# Altium project Power-LED Regulator.PrjPCB
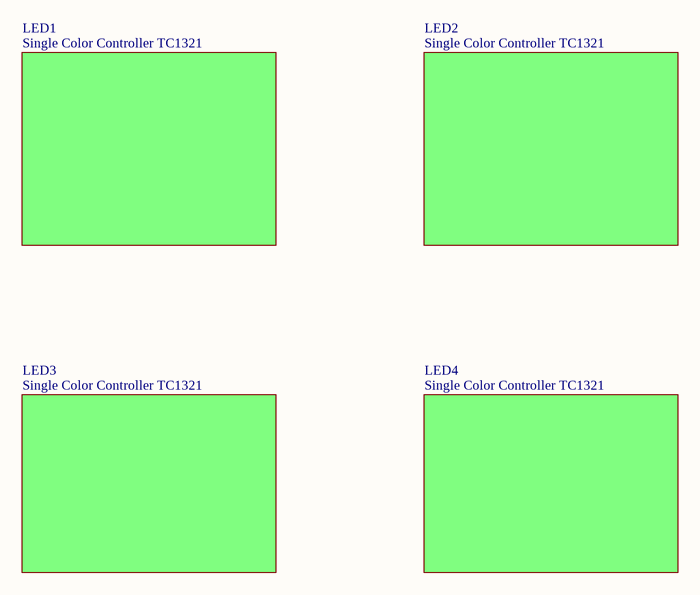
[diagram p0: Top.SchDoc]
4 sheets, 32 parts. Net scope: flat (ports and power ports of the same name join across sheets).
Sheets:
  Top.SchDoc
    LED3 = Single Color Controller TC1321.SchDoc
      Regulator = Current Controller LM258.SchDoc
      Step-Up = Boost Converter XL6009.SchDoc
    LED1 = Single Color Controller TC1321.SchDoc
      Regulator = Current Controller LM258.SchDoc
      Step-Up = Boost Converter XL6009.SchDoc
    LED4 = Single Color Controller TC1321.SchDoc
      Regulator = Current Controller LM258.SchDoc
      Step-Up = Boost Converter XL6009.SchDoc
    LED2 = Single Color Controller TC1321.SchDoc
      Regulator = Current Controller LM258.SchDoc
      Step-Up = Boost Converter XL6009.SchDoc

## Sheet Top.SchDoc
size A4

### Sub-sheets
LED1 = Single Color Controller TC1321: no entries
LED2 = Single Color Controller TC1321: no entries
LED3 = Single Color Controller TC1321: no entries
LED4 = Single Color Controller TC1321: no entries

## Sheet Single Color Controller TC1321.SchDoc
size A4
Used 4 times, as channels LED3, LED1, LED4, LED2. Parts and nets are listed once, with the designators drawn on the sheet.
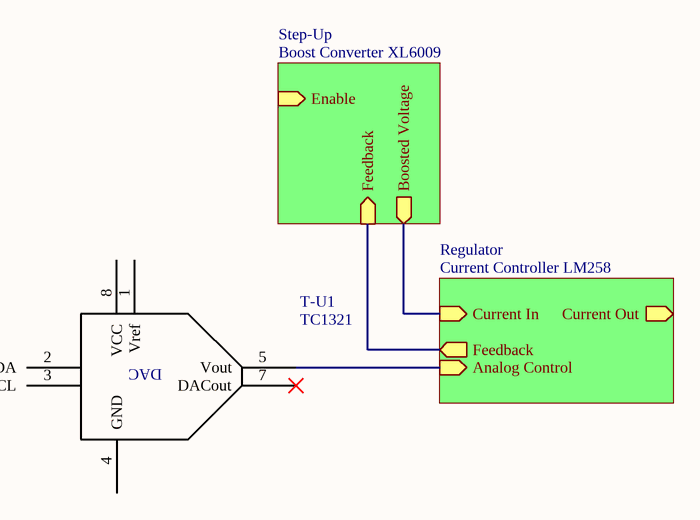
[diagram p1: Single Color Controller TC1321.SchDoc]

### Parts
T-U1  TC1321  [SOIC-8]

### Sub-sheets
Regulator = Current Controller LM258: Analog Control (in), Current In (in), Current Out (out), Feedback (out)
Step-Up = Boost Converter XL6009: Enable (in), Feedback (in), Boosted Voltage (out)

### Nets
NetT-U1_5: T-U1.5(Vout) ; sheet Regulator/Analog Control
(unnamed): sheet Regulator/Current In, sheet Step-Up/Boosted Voltage
(unnamed): sheet Regulator/Feedback, sheet Step-Up/Feedback

Not connected (* = marked no-connect by the designer): T-U1 1(Vref) 2(SDA) 3(SCL) 4(GND) 7(DACout)* 8(VCC)

### Channels
LED3: designators end in _LED3
LED1: designators end in _LED1
LED4: designators end in _LED4
LED2: designators end in _LED2

### Notes on the sheet
- (in symbol TC1321) DAC

### Library data of the parts
T-U1 = TC1321: DAC 10-Bit Two-Wire

## Sheet Current Controller LM258.SchDoc
size A4
Used 4 times, as channels LED3/Regulator, LED1/Regulator, LED4/Regulator, LED2/Regulator. Parts and nets are listed once, with the designators drawn on the sheet.
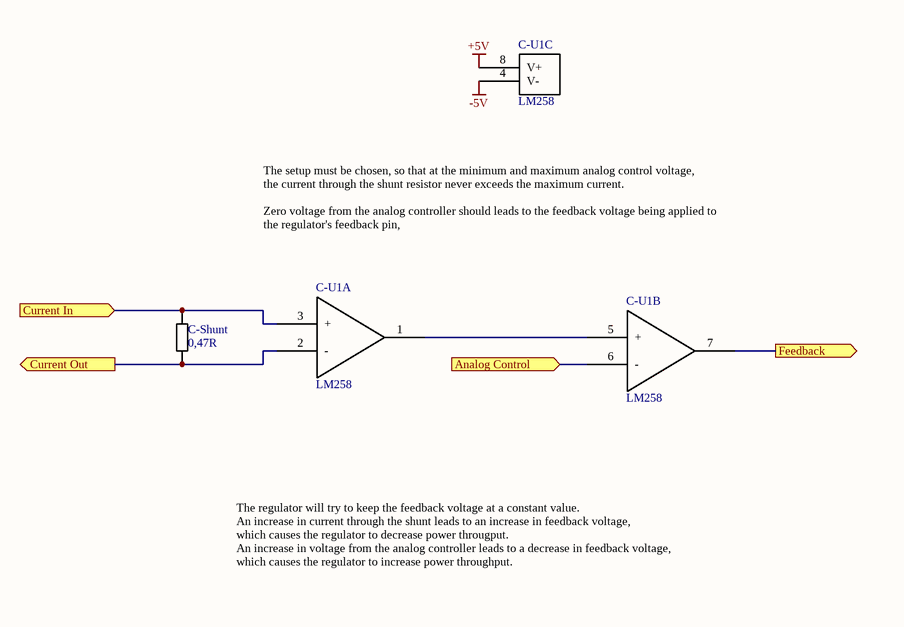
[diagram p2: Current Controller LM258.SchDoc]

### Parts
C-Shunt  0,47R  [R 0805 / 2012]
C-U1  LM258  [SOIC-8]  (parts A,B,C of 3)

### Ports
Analog Control (in), Current In (in), Current Out (out), Feedback (out)

### Nets
+5V: C-U1.8(V+)
-5V: C-U1.4(V-)
Analog Control: C-U1.6(-) ; port Analog Control
Current In: C-Shunt.2 C-U1.3(+) ; port Current In
Current Out: C-Shunt.1 C-U1.2(-) ; port Current Out
Feedback: C-U1.7(OUT) ; port Feedback
NetC-U1_1: C-U1.1(OUT) C-U1.5(+)

### Channels
LED3/Regulator: designators end in _LED3_Regulator; ports Analog Control=NetC-U1_LED1_Regulator_6 Current In=NetC-Shunt_LED1_Regulator_2 Current Out=NetC-Shunt_LED1_Regulator_1 Feedback=NetB-U1_LED1_Step-Up_5
LED1/Regulator: designators end in _LED1_Regulator; ports Analog Control=NetC-U1_LED1_Regulator_6 Current In=NetC-Shunt_LED1_Regulator_2 Current Out=NetC-Shunt_LED1_Regulator_1 Feedback=NetB-U1_LED1_Step-Up_5
LED4/Regulator: designators end in _LED4_Regulator; ports Analog Control=NetC-U1_LED1_Regulator_6 Current In=NetC-Shunt_LED1_Regulator_2 Current Out=NetC-Shunt_LED1_Regulator_1 Feedback=NetB-U1_LED1_Step-Up_5
LED2/Regulator: designators end in _LED2_Regulator; ports Analog Control=NetC-U1_LED1_Regulator_6 Current In=NetC-Shunt_LED1_Regulator_2 Current Out=NetC-Shunt_LED1_Regulator_1 Feedback=NetB-U1_LED1_Step-Up_5

### Notes on the sheet
- The setup must be chosen, so that at the minimum and maximum analog control voltage,
  the current through the shunt resistor never exceeds the maximum current.
  Zero voltage from the analog controller should leads to the feedback voltage being applied to the regulator's feedback pin,
  which causes the regulator to cease power output.
- The regulator will try to keep the feedback voltage at a constant value.
  An increase in current through the shunt leads to an increase in feedback voltage,
  which causes the regulator to decrease power througput.
  An increase in voltage from the analog controller leads to a decrease in feedback voltage,
  which causes the regulator to increase power throughput.

### Library data of the parts
C-Shunt = Resistor
C-U1 = LM258: Dual OpAmp

## Sheet Boost Converter XL6009.SchDoc
size A4
Used 4 times, as channels LED3/Step-Up, LED1/Step-Up, LED4/Step-Up, LED2/Step-Up. Parts and nets are listed once, with the designators drawn on the sheet.
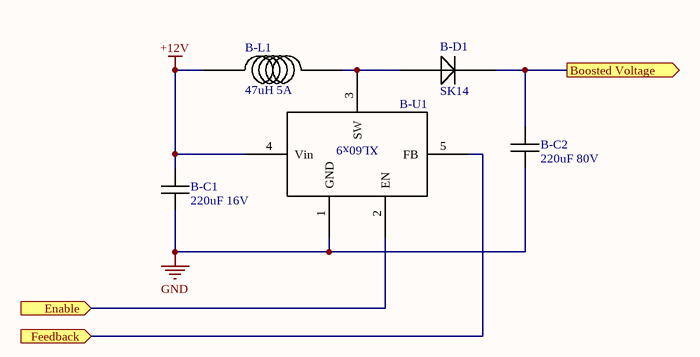
[diagram p3: Boost Converter XL6009.SchDoc]

### Parts
B-C1  220uF 16V  [C 0805 / 2012]
B-C2  220uF 80V  [C 0805 / 2012]
B-D1  SK14
B-L1  47uH 5A
B-U1  XL6009  (value not drawn)

### Ports
Boosted Voltage (out), Enable (in), Feedback (in)

### Nets
+12V: B-C1.1 B-L1.1 B-U1.4(Vin)
GND: B-C1.2 B-C2.2 B-U1.1(GND)
Boosted Voltage: B-C2.1 B-D1.1 ; port Boosted Voltage
Enable: B-U1.2(EN) ; port Enable
Feedback: B-U1.5(FB) ; port Feedback
NetB-D1_2: B-D1.2 B-L1.2 B-U1.3(SW)

### Channels
LED3/Step-Up: designators end in _LED3_Step-Up; ports Boosted Voltage=NetB-C2_LED1_Step-Up_1 Enable=NetB-U1_LED1_Step-Up_2 Feedback=NetB-U1_LED1_Step-Up_5
LED1/Step-Up: designators end in _LED1_Step-Up; ports Boosted Voltage=NetB-C2_LED1_Step-Up_1 Enable=NetB-U1_LED1_Step-Up_2 Feedback=NetB-U1_LED1_Step-Up_5
LED4/Step-Up: designators end in _LED4_Step-Up; ports Boosted Voltage=NetB-C2_LED1_Step-Up_1 Enable=NetB-U1_LED1_Step-Up_2 Feedback=NetB-U1_LED1_Step-Up_5
LED2/Step-Up: designators end in _LED2_Step-Up; ports Boosted Voltage=NetB-C2_LED1_Step-Up_1 Enable=NetB-U1_LED1_Step-Up_2 Feedback=NetB-U1_LED1_Step-Up_5

### Library data of the parts
B-C1 B-C2 = Capacitor
B-D1 = Diode
B-L1 = Coil
B-U1 = XL60x9: Buck-/Boost-Converter

## Nets that join several sheets
+5V: LED3/Regulator (C-U1_LED3_Regulator.8), LED1/Regulator (C-U1_LED1_Regulator.8), LED4/Regulator (C-U1_LED4_Regulator.8), LED2/Regulator (C-U1_LED2_Regulator.8)
+12V: LED3/Step-Up (B-C1_LED3_Step-Up.1 B-L1_LED3_Step-Up.1 B-U1_LED3_Step-Up.4), LED1/Step-Up (B-C1_LED1_Step-Up.1 B-L1_LED1_Step-Up.1 B-U1_LED1_Step-Up.4), LED4/Step-Up (B-C1_LED4_Step-Up.1 B-L1_LED4_Step-Up.1 B-U1_LED4_Step-Up.4), LED2/Step-Up (B-C1_LED2_Step-Up.1 B-L1_LED2_Step-Up.1 B-U1_LED2_Step-Up.4)
-5V: LED3/Regulator (C-U1_LED3_Regulator.4), LED1/Regulator (C-U1_LED1_Regulator.4), LED4/Regulator (C-U1_LED4_Regulator.4), LED2/Regulator (C-U1_LED2_Regulator.4)
GND: LED3/Step-Up (B-C1_LED3_Step-Up.2 B-C2_LED3_Step-Up.2 B-U1_LED3_Step-Up.1), LED1/Step-Up (B-C1_LED1_Step-Up.2 B-C2_LED1_Step-Up.2 B-U1_LED1_Step-Up.1), LED4/Step-Up (B-C1_LED4_Step-Up.2 B-C2_LED4_Step-Up.2 B-U1_LED4_Step-Up.1), LED2/Step-Up (B-C1_LED2_Step-Up.2 B-C2_LED2_Step-Up.2 B-U1_LED2_Step-Up.1)
NetB-C2_LED1_Step-Up_1: LED3/Step-Up (B-C2_LED3_Step-Up.1 B-D1_LED3_Step-Up.1), LED1/Step-Up (B-C2_LED1_Step-Up.1 B-D1_LED1_Step-Up.1), LED4/Step-Up (B-C2_LED4_Step-Up.1 B-D1_LED4_Step-Up.1), LED2/Step-Up (B-C2_LED2_Step-Up.1 B-D1_LED2_Step-Up.1)
NetB-U1_LED1_Step-Up_2: LED3/Step-Up (B-U1_LED3_Step-Up.2), LED1/Step-Up (B-U1_LED1_Step-Up.2), LED4/Step-Up (B-U1_LED4_Step-Up.2), LED2/Step-Up (B-U1_LED2_Step-Up.2)
NetB-U1_LED1_Step-Up_5: LED3/Regulator (C-U1_LED3_Regulator.7), LED3/Step-Up (B-U1_LED3_Step-Up.5), LED1/Regulator (C-U1_LED1_Regulator.7), LED1/Step-Up (B-U1_LED1_Step-Up.5), LED4/Regulator (C-U1_LED4_Regulator.7), LED4/Step-Up (B-U1_LED4_Step-Up.5), LED2/Regulator (C-U1_LED2_Regulator.7), LED2/Step-Up (B-U1_LED2_Step-Up.5)
NetC-Shunt_LED1_Regulator_1: LED3/Regulator (C-Shunt_LED3_Regulator.1 C-U1_LED3_Regulator.2), LED1/Regulator (C-Shunt_LED1_Regulator.1 C-U1_LED1_Regulator.2), LED4/Regulator (C-Shunt_LED4_Regulator.1 C-U1_LED4_Regulator.2), LED2/Regulator (C-Shunt_LED2_Regulator.1 C-U1_LED2_Regulator.2)
NetC-Shunt_LED1_Regulator_2: LED3/Regulator (C-Shunt_LED3_Regulator.2 C-U1_LED3_Regulator.3), LED1/Regulator (C-Shunt_LED1_Regulator.2 C-U1_LED1_Regulator.3), LED4/Regulator (C-Shunt_LED4_Regulator.2 C-U1_LED4_Regulator.3), LED2/Regulator (C-Shunt_LED2_Regulator.2 C-U1_LED2_Regulator.3)
NetC-U1_LED1_Regulator_6: LED3/Regulator (C-U1_LED3_Regulator.6), LED1/Regulator (C-U1_LED1_Regulator.6), LED4/Regulator (C-U1_LED4_Regulator.6), LED2/Regulator (C-U1_LED2_Regulator.6)